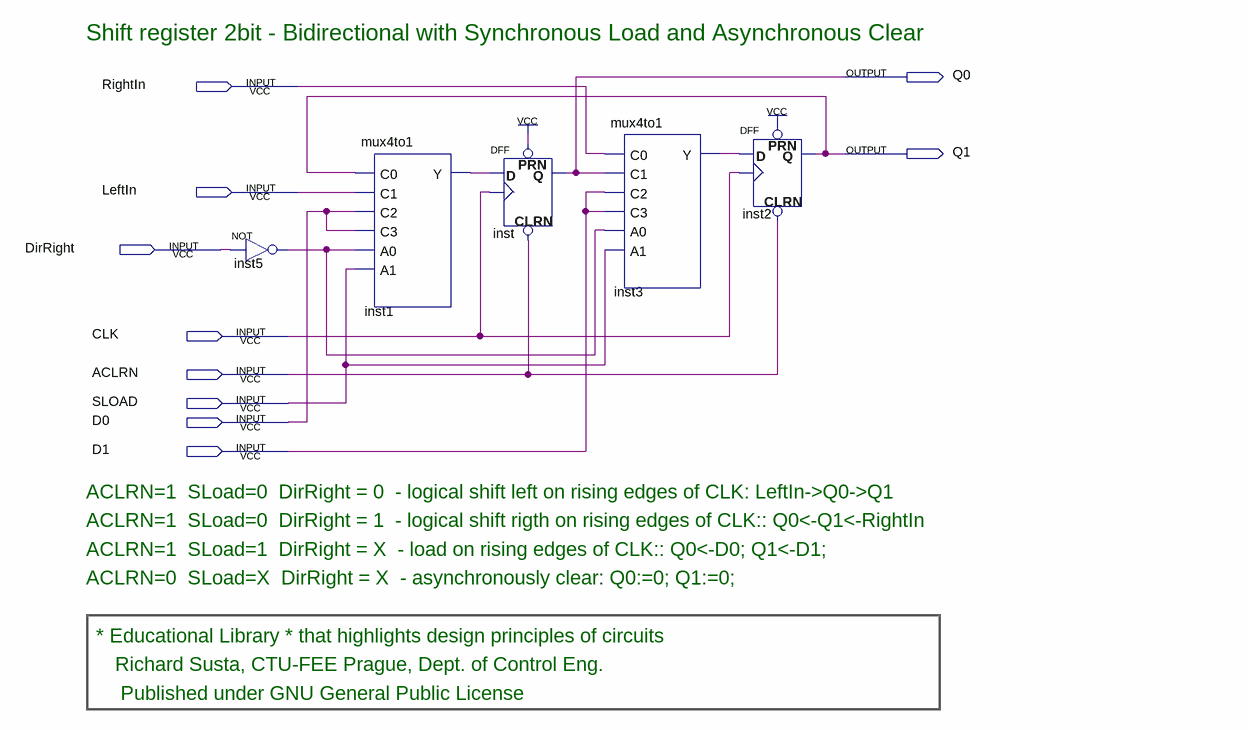
[diagram p0: schematic sheet]
// Quartus schematic shift2bidirload.bdf as structural Verilog: 5 symbols, 10 pins
module shift2bidirload (
  input  RightIn,
  input  LeftIn,
  input  DirRight,
  input  CLK,
  input  ACLRN,
  input  SLOAD,
  input  D0,
  input  D1,
  output Q0,
  output Q1
);

  wire inst1_y, inst3_y, inst5_out;

  not inst5 (inst5_out, DirRight);
  mux4to1 inst1 (.C0(Q1), .C1(LeftIn), .C2(D0), .C3(D0), .A0(inst5_out), .A1(SLOAD), .Y(inst1_y));
  DFF inst (.CLRN(ACLRN), .CLK(CLK), .D(inst1_y), .PRN(1'b1), .Q(Q0));
  mux4to1 inst3 (.C0(RightIn), .C1(Q0), .C2(D1), .C3(D1), .A0(inst5_out), .A1(SLOAD), .Y(inst3_y));
  DFF inst2 (.CLRN(ACLRN), .CLK(CLK), .D(inst3_y), .PRN(1'b1), .Q(Q1));

  // Notes on the sheet:
  //   Shift register 2bit - Bidirectional with Synchronous Load and Asynchronous Clear
  //   ACLRN=1  SLoad=0  DirRight = 0  - logical shift left on rising edges of CLK: LeftIn->Q0->Q1
  //   ACLRN=1  SLoad=0  DirRight = 1  - logical shift rigth on rising edges of CLK:: Q0<-Q1<-RightIn
  //   ACLRN=1  SLoad=1  DirRight = X  - load on rising edges of CLK:: Q0<-D0; Q1<-D1;
  //   ACLRN=0  SLoad=X  DirRight = X  - asynchronously clear: Q0:=0; Q1:=0;
  //   * Educational Library * that highlights design principles of circuits
  //   Richard Susta, CTU-FEE Prague, Dept. of Control Eng. 
  //    Published under GNU General Public License
endmodule
